# EAGLE design Bluetooth (EAGLE 6.0)
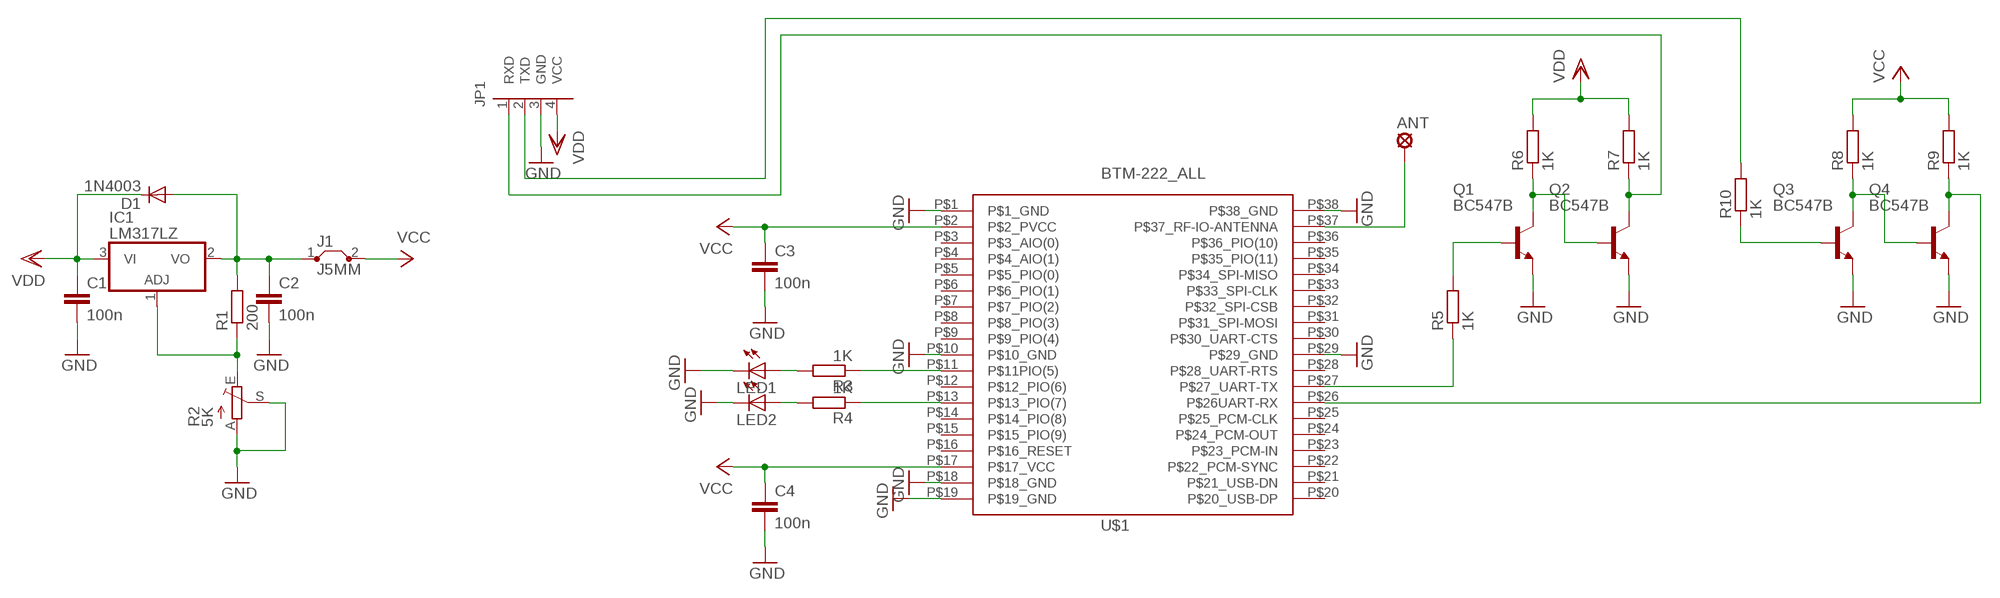
[diagram p0: schematic, sheet 1]

## Parts
ANT  SE14  [SE14]
C1  100n  C-EU050-030X075  [C050-030X075]
C2  100n  C-EU050-030X075  [C050-030X075]
C3  100n  C-EU050-030X075  [C050-030X075]
C4  100n  C-EU050-030X075  [C050-030X075]
D1  1N4003  1N4004  [DO41-10]
IC1  LM317LZ  [TO92]
J1  J5MM  [05]
JP1  RS232_TTL  [1X04]
LED1  LED3MM  [LED3MM]
LED2  LED3MM  [LED3MM]
Q1  BC547B  [TO92]
Q2  BC547B  [TO92]
Q3  BC547B  [TO92]
Q4  BC547B  [TO92]
R1  200  R-EU_0207/10  [0207/10]
R2  5K  TRIM_EU-PT10S  [PT-10S]
R3  1K  R-EU_0207/10  [0207/10]
R4  1K  R-EU_0207/10  [0207/10]
R5  1K  R-EU_0207/10  [0207/10]
R6  1K  R-EU_0207/10  [0207/10]
R7  1K  R-EU_0207/10  [0207/10]
R8  1K  R-EU_0207/10  [0207/10]
R9  1K  R-EU_0207/10  [0207/10]
R10  1K  R-EU_0207/10  [0207/10]
U$1  BTM-222_ALL  [BTM-222]

## Nets
GND: C1.2 C2.2 C3.2 C4.2 JP1.3(GND) LED1.K(C) LED2.K(C) Q1.1(E) Q2.1(E) Q3.1(E) Q4.1(E) R2.A R2.S U$1.P$1(P$1_GND) U$1.P$10(P$10_GND) U$1.P$18(P$18_GND) U$1.P$19(P$19_GND) U$1.P$29(P$29_GND) U$1.P$38(P$38_GND)
N$1: R3.1 U$1.P$11(P$11PIO(5))
N$2: LED1.A R3.2
N$3: IC1.1(ADJ) R1.1 R2.E
N$4: R4.1 U$1.P$13(P$13_PIO(7))
N$5: LED2.A R4.2
N$6: Q1.2(B) R5.2
N$7: JP1.1(RXD) Q2.3(C) R7.1
N$8: Q1.3(C) Q2.2(B) R6.1
N$9: JP1.2(TXD) R10.2
N$10: Q3.2(B) R10.1
N$12: R5.1 U$1.P$27(P$27_UART-TX)
N$14: Q3.3(C) Q4.2(B) R8.1
N$15: Q4.3(C) R9.1 U$1.P$26(P$26UART-RX)
N$23: ANT.MP U$1.P$37(P$37_RF-IO-ANTENNA)
N$24: C2.1 D1.A IC1.2(VO) J1.1 R1.2
VCC: C3.1 C4.1 J1.2 R8.2 R9.2 U$1.P$2(P$2_PVCC) U$1.P$17(P$17_VCC)
VDD: C1.1 D1.C IC1.3(VI) JP1.4(VCC) R6.2 R7.2
Unconnected: U$1.P$3(P$3_AIO(0)) U$1.P$4(P$4_AIO(1)) U$1.P$5(P$5_PIO(0)) U$1.P$6(P$6_PIO(1)) U$1.P$7(P$7_PIO(2)) U$1.P$8(P$8_PIO(3)) U$1.P$9(P$9_PIO(4)) U$1.P$12(P$12_PIO(6)) U$1.P$14(P$14_PIO(8)) U$1.P$15(P$15_PIO(9)) U$1.P$16(P$16_RESET) U$1.P$20(P$20_USB-DP) U$1.P$21(P$21_USB-DN) U$1.P$22(P$22_PCM-SYNC) U$1.P$23(P$23_PCM-IN) U$1.P$24(P$24_PCM-OUT) U$1.P$25(P$25_PCM-CLK) U$1.P$28(P$28_UART-RTS) U$1.P$30(P$30_UART-CTS) U$1.P$31(P$31_SPI-MOSI) U$1.P$32(P$32_SPI-CSB) U$1.P$33(P$33_SPI-CLK) U$1.P$34(P$34_SPI-MISO) U$1.P$35(P$35_PIO(11)) U$1.P$36(P$36_PIO(10))

## Library data of the parts
ANT = solpad:SE14: SOLDER PAD E1553, drill 1,4mm, distributor Buerklin, 07F820
C1-C4 = resistor:C-EU: CAPACITOR, European symbol
D1 = diode:1N4004: DIODE general purpose rectifier, 1 A
IC1 = linear:*317: Positive VOLTAGE REGULATOR
J1 = jumper:J: Bridge
JP1 = 0-roboternetz-definitionen:RS232_TTL: RS232 Stecker TTL-Pegel ( für externe Pegelwandler für RS485 o.ä. )
LED1 LED2 = led:LED: LED OSRAM: - CHIPLED LG R971, LG N971, LY N971, LG Q971, LY Q971, LO R971, LY R971 LH N974, LH R974 LS Q976, LO Q976, LY Q976 LO Q996 - Hyper CHIPLED LW Q18S LB Q993, LB Q99A, LB R99A - SideLED LS A670, LO A670, LY A670, LG A670, LP A670 LB A673, LV A673, LT A673, LW A673 LH A674 LY A675 LS A676, LA A676, LO A676, LY A676, LW A676 LS A679, LY A679, LG A679 - Hyper Micro SIDELED® LS Y876, LA Y876, LO Y876, LY Y876 LT Y87S - SmartLED LW L88C, LW L88S LB L89C, LB L89S, LG L890 LS L89K, LO L89K, LY L89K LS L896, LA L896, LO L896, LY L896 - TOPLED LS T670, LO T670, LY T670, LG T670, LP T670 LSG T670, LSP T670, LSY T670, LOP T670, LYG T670 LG T671, LOG T671, LSG T671 LB T673, LV T673, LT T673, LW T673 LH T674 LS T676, LA T676, LO T676, LY T676, LB T676, LH T676, LSB T676, LW T676 LB T67C, LV T67C, LT T67C, LS T67K, LO T67K, LY T67K, LW E67C LS E67B, LA E67B, LO E67B, LY E67B, LB E67C, LV E67C, LT E67C LW T67C LS T679, LY T679, LG T679 LS T770, LO T770, LY T770, LG T770, LP T770 LB T773, LV T773, LT T773, LW T773 LH T774 LS E675, LA E675, LY E675, LS T675 LS T776, LA T776, LO T776, LY T776, LB T776 LHGB T686 LT T68C, LB T68C - Hyper Mini TOPLED® LB M676 - Mini TOPLED Santana® LG M470 LS M47K, LO M47K, LY M47K Source: http://www.osram.convergy.de LUXEON: - LUMILED® LXK2-PW12-R00, LXK2-PW12-S00, LXK2-PW14-U00, LXK2-PW14-V00 LXK2-PM12-R00, LXK2-PM12-S00, LXK2-PM14-U00 LXK2-PE12-Q00, LXK2-PE12-R00, LXK2-PE12-S00, LXK2-PE14-T00, LXK2-PE14-U00 LXK2-PB12-K00, LXK2-PB12-L00, LXK2-PB12-M00, LXK2-PB14-N00, LXK2-PB14-P00, LXK2-PB14-Q00 LXK2-PR12-L00, LXK2-PR12-M00, LXK2-PR14-Q00, LXK2-PR14-R00 LXK2-PD12-Q00, LXK2-PD12-R00, LXK2-PD12-S00 LXK2-PH12-R00, LXK2-PH12-S00 LXK2-PL12-P00, LXK2-PL12-Q00, LXK2-PL12-R00 Source: www.luxeon.com KINGBRIGHT: KA-3528ASYC Source: www.kingbright.com
Q1-Q4 = transistor-npn:BC547*: NPN Transistor
R1 R3-R10 = resistor:R-EU_: RESISTOR, European symbol
R2 = pot:TRIM_EU-: POTENTIOMETER
U$1 = 0-BTM_222:BTM-222_ALL

## Board
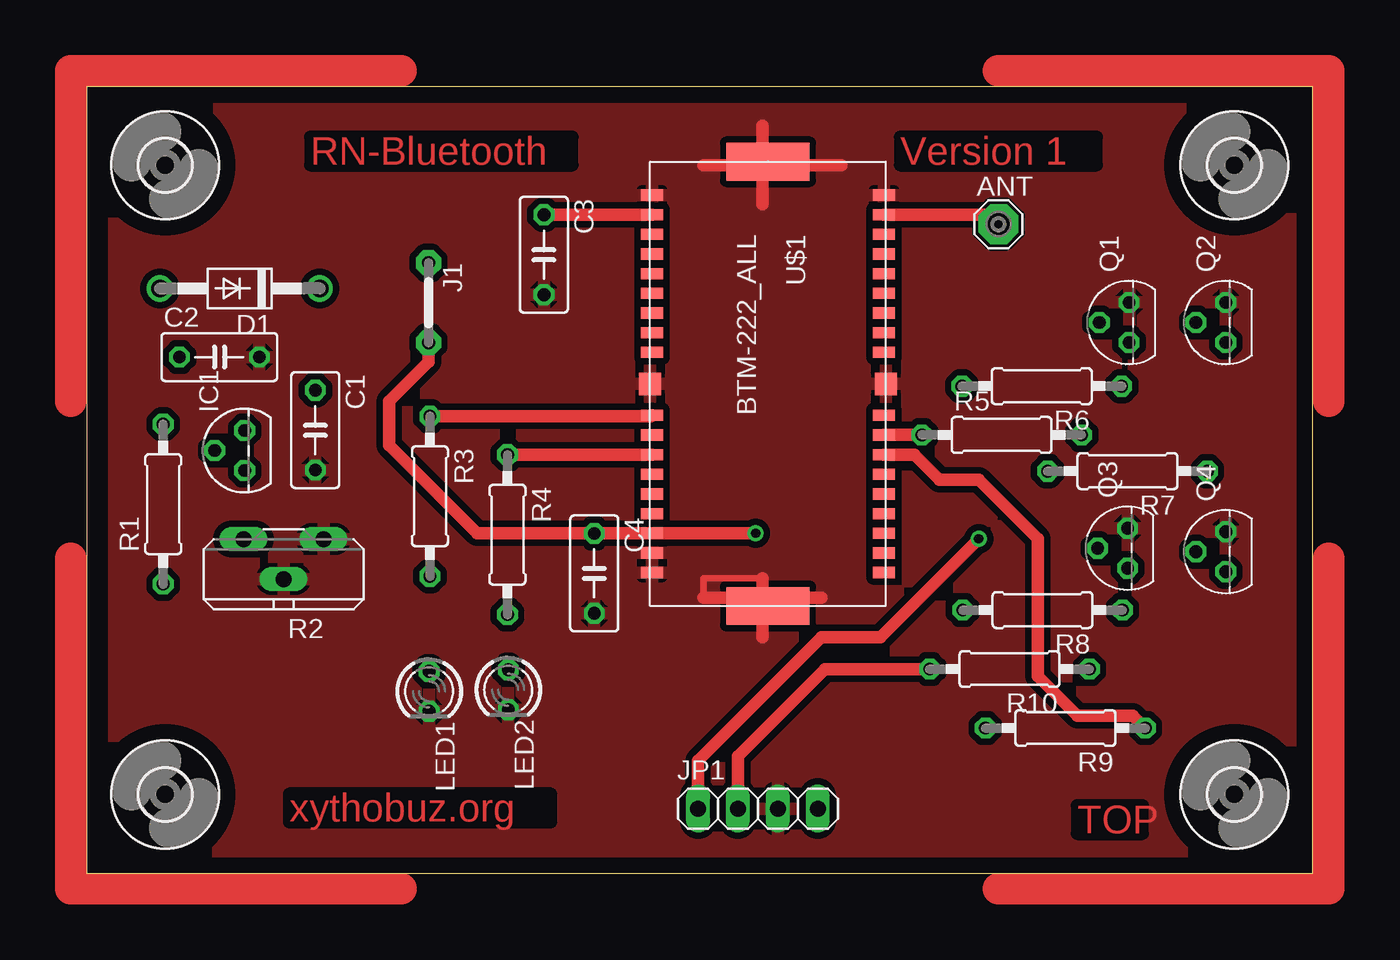
[diagram p1: board, top side]
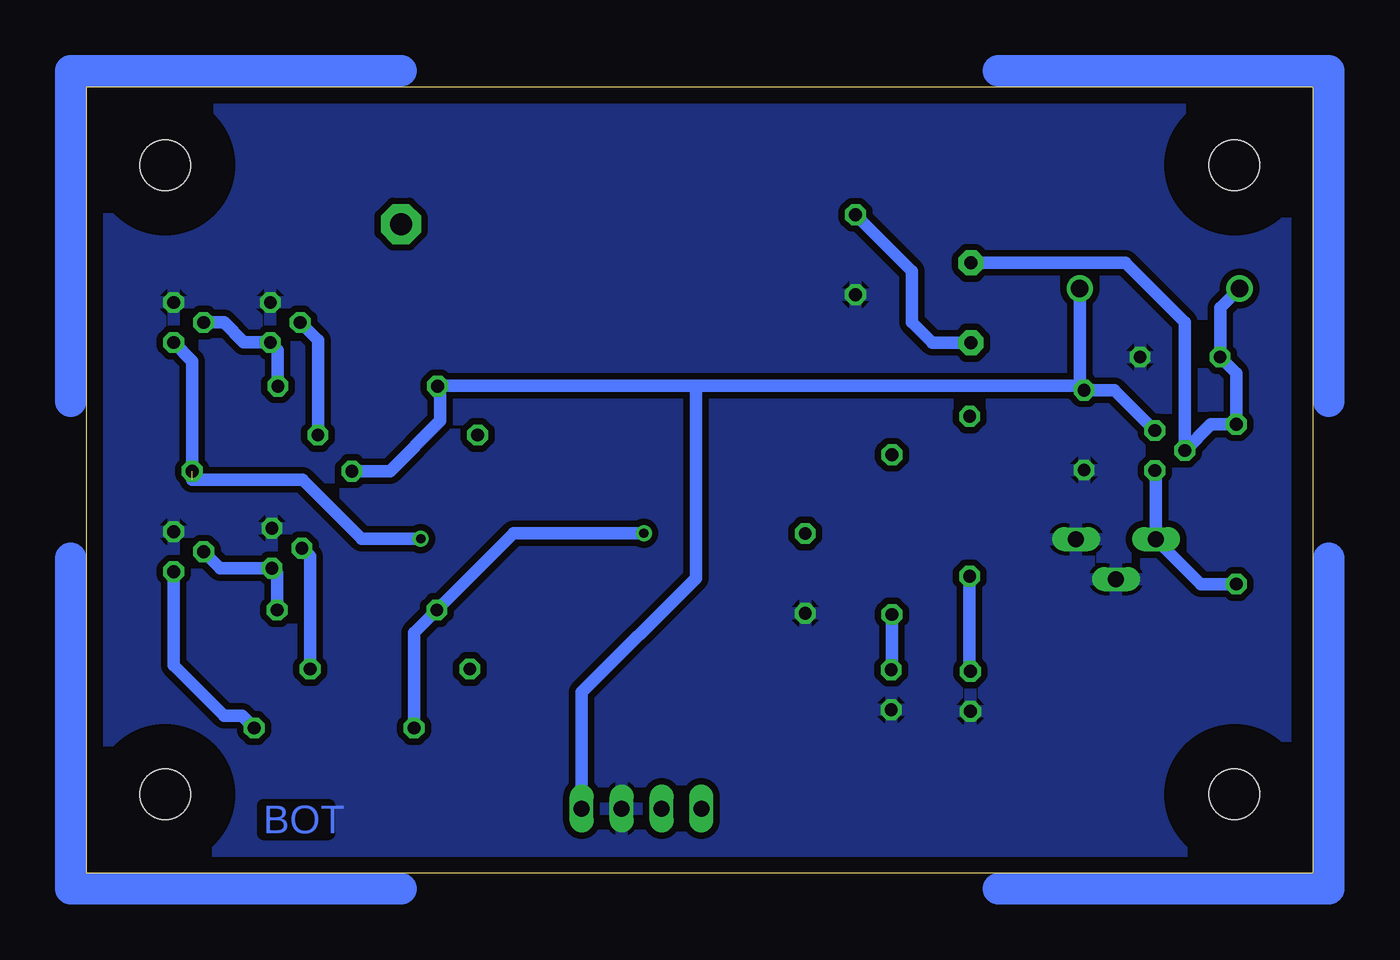
[diagram p2: board, bottom side, seen from below]

Size 78 x 50 mm. Coordinates in mm from the lower left corner, seen from the top.
Outline: 78,0 78,50 0,50 0,0 78,0
Copper layers (1*16): Top 0.035mm / dielectric 1.5mm / Bottom 0.035mm
Design rules: minimum track width 10mil, minimum drill 24mil, track to track 8mil, track to pad 8mil, pad to pad 8mil, via to via 8mil, smd to smd 8mil, copper to edge 40mil, drill to drill 8mil, minimum pad ring 10mil, minimum via ring 8mil, stop-mask expansion 4mil, vias tented up to drill 0mil, thermal gap 10mil

### Footprints (pad centres in the part's own frame; a part is rotated, then mirrored left to right if it is on the bottom)
SE14 = drill 1.397 pad 2.54 octagon: MP 0,0
C050-030X075 = drill 0.813 octagon: 1 -2.54,0; 2 2.54,0
DO41-10 = drill 1.118: A 5.08,0; C -5.08,0
TO92 = drill 0.813 octagon: 1 -1.27,0; 2 0,1.905; 3 1.27,0
05 = drill 0.813 pad 1.6 octagon: 1 -2.54,0; 2 2.54,0
1X04 = drill 1.016 long: 1 -3.81,0; 2 -1.27,0; 3 1.27,0; 4 3.81,0
LED3MM = drill 0.813 octagon: A -1.27,0; K 1.27,0
TO92' = drill 0.813 octagon: 1 1.27,0; 2 0,1.905; 3 -1.27,0
0207/10 = drill 0.813 octagon: 1 -5.08,0; 2 5.08,0
PT-10S = drill 1.016 long: A -2.54,-1.27; E 2.54,-1.27; S 0,1.27
BTM-222 = smd 2.4 x 5.3: $AGND -14.625,3.75; $BGND 13.625,3.75 | smd 0.711 x 1.422: P$1 -12.5,-3.625; P$2 -11.25,-3.625; P$3 -10,-3.625; P$4 -8.75,-3.625; P$5 -7.5,-3.625; P$6 -6.25,-3.625; P$7 -5,-3.625; P$8 -3.75,-3.625; P$9 -2.5,-3.625; P$11 1.5,-3.625; P$12 2.75,-3.625; P$13 4,-3.625; P$14 5.25,-3.625; P$15 6.5,-3.625; P$16 7.75,-3.625; P$17 9,-3.625; P$18 10.25,-3.625; P$19 11.5,-3.625; P$20 11.5,11.125; P$21 10.25,11.125; P$22 9,11.125; P$23 7.75,11.125; P$24 6.5,11.125; P$25 5.25,11.125; P$26 4,11.125; P$27 2.75,11.125; P$28 1.5,11.125; P$30 -2.5,11.125; P$31 -3.75,11.125; P$32 -5,11.125; P$33 -6.25,11.125; P$34 -7.5,11.125; P$35 -8.75,11.125; P$36 -10,11.125; P$37 -11.25,11.125; P$38 -12.5,11.125 | smd 1.422 x 1.4: P$10 -0.5,-3.75; P$29 -0.5,11.25
3,2 = hole 3.2: 0,0

### Placement (x,y rotation side)
ANT  58,41.25 0 top
C1  14.55,28.16 270 top
C2  8.45,32.8 0 top
C3  29.09,39.31 270 top
C4  32.29,19.05 270 top
D1  9.75,37.16 180 top
IC1  10.06,26.86 90 top
J1  21.75,36.25 270 top
JP1  42.7,4.09 0 top
LED1  21.79,11.55 270 top
LED2  26.82,11.65 270 top
Q1  BC547B  [TO92']  66.31,35 90 top
Q2  BC547B  [TO92']  72.46,35 90 top
Q3  BC547B  [TO92']  66.21,20.65 90 top
Q4  BC547B  [TO92']  72.46,20.43 90 top
R1  4.88,23.45 90 top
R2  12.53,19.96 180 top
R3  21.84,23.95 270 top
R4  26.77,21.51 270 top
R5  58.2,27.85 0 top
R6  60.75,30.95 180 top
R7  66.2,25.55 180 top
R8  60.8,16.72 180 top
R9  62.25,9.22 180 top
R10  58.7,12.97 180 top
U$1  39.59,30.6 270 top
U$2  [3,2]  73,5 90 top
U$3  [3,2]  73,45 90 top
U$4  [3,2]  5,5 90 top
U$5  [3,2]  5,45 90 top

### Tracks (layer width: path | path; a pad name or v marks a point on that pad's centre or on a via)
GND
  Top 0.406: 43,18.75 39.25,18.75 39.25,17.5
  Top 0.8: 39.25,17.5 46.75,17.5 | 43,18.75 43,15 | 43,42.5 43,47.5 | 39.25,45 48,45
  pour Top (isolate 0.406): 5.5,1.25 73,1.25 73,5 76.75,5 76.75,45 73,45 73,48.75 4.25,48.75 4.25,45 1.75,45 1.75,5 4.25,5 4.25,1.25
  pour Bottom (isolate 0.406): 5.5,1.25 5.5,5 1.75,5 1.75,45 5.5,45 5.5,48.75 73,48.75 73,45 76.75,45 76.75,5 73,5 73,1.25
N$1
  Top 0.8: R3.1 35.9,29.03 U$1.P$11
N$2
  Bottom 0.8: R3.2 21.84,12.87 LED1.A
N$3
  Bottom 0.8: IC1.1 9.99,25.52 R2.E 7.13,18.37 R1.1
N$4
  Top 0.8: R4.1 35.95,26.59 U$1.P$13
N$5
  Bottom 0.8: R4.2 26.77,12.97 LED2.A
N$6
  Bottom 0.8: R5.2 63.28,33.88 Q1.2
N$7  (via drill 0.6)  (1 unrouted)
  Top 0.8: JP1.1 38.89,7.14 46.75,15 50.5,15 v56.75,21.25
  Bottom 0.8: R7.1 71.28,32.55 Q2.3 | v56.75,21.25 60.5,21.25 64.25,25 71.28,25
N$8
  Bottom 0.8: Q2.2 69.25,35 68,33.75 66.33,33.75 Q1.3 65.83,33.25 R6.1
N$9
  Top 0.8: JP1.2 41.43,7.43 46.95,12.95 52.35,12.95 R10.2
N$10
  Bottom 0.8: R10.1 63.78,20.12 Q3.2
N$11
  Top 2: 79,20 79,-1 58,-1
N$12
  Top 0.8: U$1.P$27 R5.1
N$13
  Top 2: 79,30 79,51 58,51
N$14
  Bottom 0.8: R8.1 65.88,19.05 Q3.3 69.5,19.38 Q4.2
N$15
  Top 0.8: U$1.P$26 52.65,26.6 54.25,25 56.75,25 60.5,21.25 60.5,12.5 63,10 66.55,10 R9.1
  Bottom 0.8: Q4.3 72.46,13.21 69.25,10 68.11,10 R9.1
N$16
  Top 2: -1,20 -1,-1 20,-1
N$17
  Top 2: 20,51 -1,51 -1,30
N$18
  Bottom 2: 79,20 79,-1 58,-1
N$19
  Bottom 2: 79,30 79,51 58,51
N$20
  Bottom 2: -1,20 -1,-1 20,-1
N$21
  Bottom 2: 20,51 -1,51 -1,30
N$23
  Top 0.8: U$1.P$37 57.4,41.85 ANT.MP
N$24
  Bottom 0.8: D1.A 5.91,35.92 C2.1 4.88,31.77 R1.2 6.49,28.53 IC1.2 8.15,35.01 11.95,38.8 J1.1
VCC  (via drill 0.6)
  Top 0.8: C3.1 U$1.P$2 | v42.55,21.6 U$1.P$17 35.95,21.59 C4.1 24.85,21.6 19.25,27.2 19.25,30 21.75,32.5 J1.2
  Bottom 0.8: R9.2 57.17,15.27 R8.2 50.84,21.6 v42.55,21.6 | J1.2 24.21,33.71 25.5,35 25.5,38.26 C3.1
VDD
  Bottom 0.8: R7.2 58.7,25.55 55.5,28.75 55.5,30.78 R6.2 55.64,30.98 39.25,30.98 | IC1.3 12.63,30.7 C1.1 14.83,30.98 | 14.83,30.98 D1.C | JP1.4 46.51,11.49 39.25,18.75 39.25,30.98 | 14.83,30.98 39.25,30.98

### Text on the board
Top: RN-Bluetooth | Version 1 | xythobuz.org | TOP
Bottom: BOT